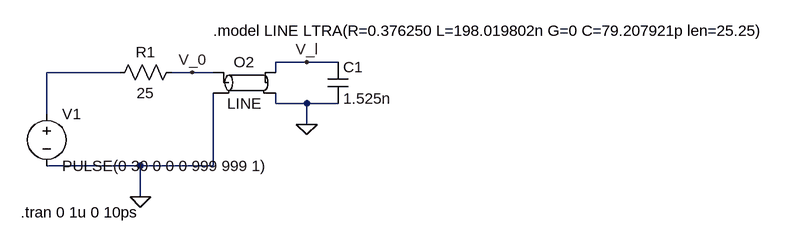
[diagram p0: schematic 1e.asc]
1e.asc, the LTspice schematic file:
Version 4.1
SHEET 1 1464 680
WIRE 560 80 512 80
WIRE 608 80 560 80
WIRE 272 96 160 96
WIRE 384 96 352 96
WIRE 416 96 384 96
WIRE 512 96 512 80
WIRE 512 144 512 128
WIRE 560 144 512 144
WIRE 608 144 560 144
WIRE 160 160 160 96
WIRE 560 176 560 144
WIRE 304 240 160 240
WIRE 416 240 416 128
WIRE 416 240 304 240
WIRE 304 288 304 240
FLAG 304 288 0
FLAG 560 176 0
FLAG 384 96 V_0
FLAG 560 80 V_l
SYMBOL res 256 112 R270
WINDOW 0 32 56 VTop 2
WINDOW 3 0 56 VBottom 2
SYMATTR InstName R1
SYMATTR Value 25
SYMBOL voltage 160 144 R0
WINDOW 123 0 0 Left 0
WINDOW 39 0 0 Left 0
SYMATTR InstName V1
SYMATTR Value PULSE(0 30 0 0 0 999 999 1)
SYMBOL cap 592 80 R0
SYMATTR InstName C1
SYMATTR Value 1.525n
SYMBOL ltline 464 112 R0
SYMATTR InstName O2
SYMATTR Value LINE
TEXT 120 312 Left 2 !.tran 0 1u 0 10ps
TEXT 416 32 Left 2 !.model LINE LTRA(R=0.376250 L=198.019802n G=0 C=79.207921p len=25.25)

The netlist it stands for:
* 1e.asc
R1 N001 V_0 25
V1 N001 0 PULSE(0 30 0 0 0 999 999 1)
C1 V_l 0 1.525n
O2 V_0 0 V_l 0 LINE
.tran 0 1u 0 10ps
.model LINE LTRA(R=0.376250 L=198.019802n G=0 C=79.207921p len=25.25)
.backanno
.end